# Altium schematic sheet DC1_ADC_Conditioning.SchDoc
size 420 x 297 mm; ENG_APP_DATE: --/--/--; DSN_APP_DATE: --/--/--; CHK_APP_DATE: --/--/--
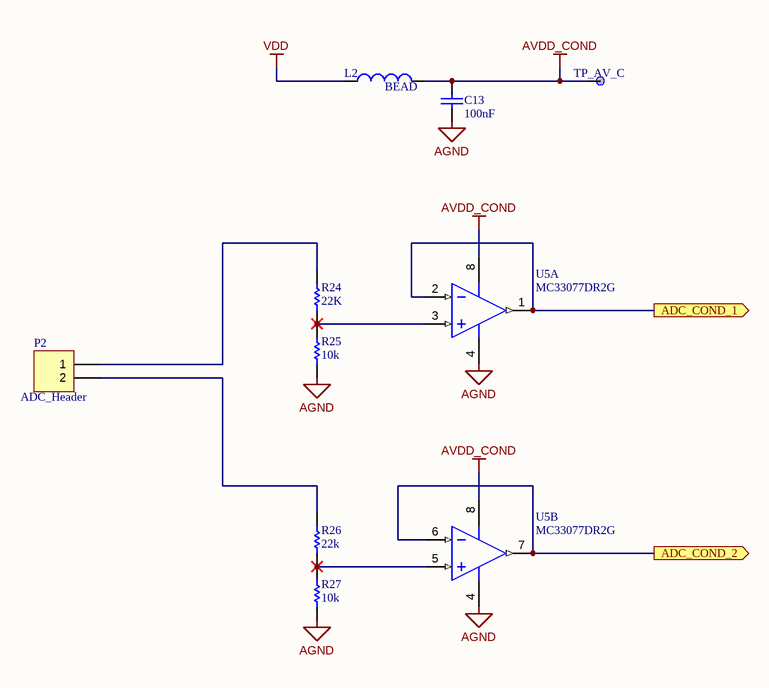
[diagram p0: DC1_ADC_Conditioning.SchDoc]

## Parts
C13  100nF  [0603C]
L2  BEAD  [0603L]
P2  ADC_Header  [HDR1X2]
R24  22K  [0603R]
R25  10k  [0603R]
R26  22k  [0603R]
R27  10k  [0603R]
TP_AV_C  TP_AVDD_C  [TP]  (value not drawn)
U5  MC33077DR2G  [ONSC-SOIC-8-751-07_V]  (parts A,B of 2)

## Ports
ADC_COND_1 (out), ADC_COND_2 (out)

## Nets
AGND: C13.2 R25.1 R27.1 U5.4(VEE)
AVDD_COND: C13.1 L2.2 TP_AV_C.1 U5.8(VCC)
VDD: L2.1
ADC_COND_1: U5.1(OUT1) U5.2(IN1-) ; port ADC_COND_1
ADC_COND_2: U5.6(IN2-) U5.7(OUT2) ; port ADC_COND_2
NetP2_1: P2.1 R24.2
NetP2_2: P2.2 R26.2
NetR24_1: R24.1 R25.2 U5.3(IN1+)
NetR26_1: R26.1 R27.2 U5.5(IN2+)

## Notes on the sheet
- MEMBERS:
- Universitat Politècnica de València
- - Gianmarco Leopoldo Sangoi
- - Vicente Beltrán Morte
- PROJECT:
- SIZE:
- FILE NAME:
- A3
- NUMBER:
- 6
- REVISION:
- A1
- DATE:
- 07/05/2022
- SHEET
- OF
- 7

## Library data of the parts
C13 = Cap: Capacitor; Value: 10nF; Published: 8-Jun-2000; Revision: July-2002: Re-released for DXP Platform.; Publisher: Altium Limited
L2 = Inductor: Value: 100uH; Published: 8-Jun-2000; Revision: July-2002: Re-released for DXP Platform.; Publisher: Altium Limited
P2 = Header 2: Header, 2-Pin; LatestRevisionDate: 17-Jul-2002; LatestRevisionNote: Re-released for DXP Platform.; Publisher: Altium Limited
R24-R27 = Res1: Resistor; Value: 1K; Ordered by: Subcon; Published: 8-Jun-2000; Revision: July-2002: Re-released for DXP Platform.; Publisher: Altium Limited
TP_AV_C = TP
U5 = CMP-1310-00366-1: Low Noise Dual Operational Amplifier, 5 to 36 V, -40 to 85 degC, 8-Pin SOIC, Pb-Free, Tape and Reel; Manufacturer: On Semiconductor; GBW Typ (MHz): 37; SR Typ (V/uS): 11; VCC Max (V): 36; VCC Min (V): 5; ComponentLink2Description: Datasheet; RoHS: TRUE; PackageReference: SOIC-8-751-07; DatasheetVersion: Rev. 5; Packing: Tape and Reel; PackageDescription: 8-Pin Small Outline Integrated Circuit, Body 4.9 x 3.9 mm, Pitch 1.27 mm; ComponentLink3URL: http://www.onsemi.com/pub_link/Collateral/751-07.PDF; ComponentLink3Description: Package Specification; Mounting Technology: Surface Mount; ComponentLink2URL: http://www.onsemi.cn/pub_link/Collateral/MC33077-D.PDF; ComponentLink1Description: Manufacturer URL; PackageVersion: Rev. AK, 02/2011; PartNumber: MC33077DR2G; ComponentLink1URL: http://www.onsemi.com/